# Altium schematic sheet STATUS_RGB.SchDoc
size Legal; Author: Mark & Qiming; DocumentNumber: 4; SheetNumber: 4; SheetTotal: 9
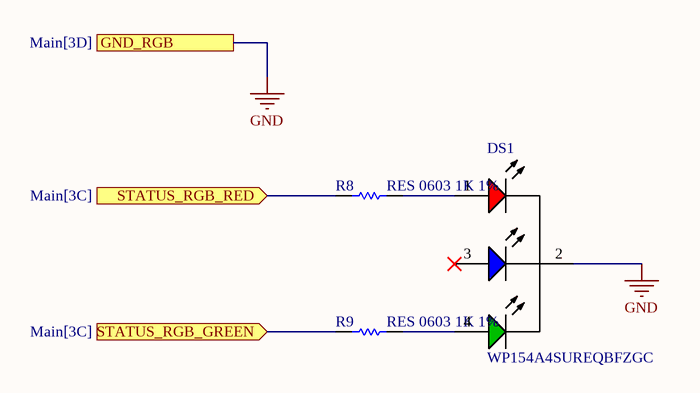
[diagram p0: STATUS_RGB.SchDoc]

## Parts
DS1  WP154A4SUREQBFZGC  [KING-WP154A4SUREQBFZGC_V]
R8  RES 0603 1K 1%  [0603_RES]
R9  RES 0603 1K 1%  [0603_RES]

## Ports
GND_RGB (see Main[3D]), STATUS_RGB_GREEN (in, see Main[3C]), STATUS_RGB_RED (in, see Main[3C])

## Nets
GND: DS1.2(CATHODE) ; port GND_RGB
STATUS_RGB_GREEN: R9.2 ; port STATUS_RGB_GREEN
STATUS_RGB_RED: R8.2 ; port STATUS_RGB_RED
NetDS1_1: DS1.1(RED) R8.1
NetDS1_4: DS1.4(GREEN) R9.1

Not connected (* = marked no-connect by the designer): DS1 3(BLUE)*

## Notes on the sheet
- Title:
- Desc:
- Size:
- Letter
- Auth:
- Proj:
- Sheet
- of
- www.seas.upenn.edu
- Electrical and Systems Engineering

## Library data of the parts
DS1 = CMP-2000-07415-1: Full Color LED Lamp, Dominant Wavelength RGB 630 / 525 / 465 nm, -40 to 85 degC, 4-Pin THD, RoHS; Manufacturer: Kingbright; Viewing Angle: 50°; Wavelength - Dominant: 630nm,525nm,465nm; Online Catalog: 5mm,T-13/4(RGB)RoundwithDomedTopLEDLamp; Millicandela Rating: 1300mcdRed,1700mcdGreen,900mcdBlue; Other Names: 754-1615 / WP154A4SUREQBFZGC-ND; Current - Test: 20mA; Wavelength - Peak: 645nm,515nm,460nm; Color: Red,Green,Blue(RGB); Voltage - Forward (Vf) (Typ): 1.9VRed,3.3VGreen,3.3VBlue; Lens Type: Clear; 3D Model: WP154A4SUREQBFZGW.sldprt / WP154A4SUREQBFZGW.pro / WP154A4SUREQBFZGW.igs / WP154A4SUREQBFZGW.stp; Lens Style/Size: RoundwithDomedTop,5mm,T-13/4; Packaging: Bulk; Datasheet URL: https://www.kingbrightusa.com/images/catalog/spec/WP154A4SUREQBFZGC.pdf; Family: LEDIndication-Discrete; Datasheet Version: Rev. 5A, 08/2014; Category: Optoelectronics; Manufacturer URL: http://www.kingbright.com/; Height: 8.60mm; Mounting Type: ThroughHole; Package Reference: WP154A4SUREQBFZGC; Mounting Technology: ThroughHole; Package Description: 4-Pin Through Hole LED, Dia 5.9 mm, Pitch 1.27 mm; Standard Package: 500; Package / Case: Radial-4Leads; ComponentLink1Description: New link; ComponentLink1URL: *
R8 R9 = CMP-005-002503-3: Resistor Surface Mount, 1K Ohms, 0603 Footprint, 1% Tolerance 0.1W; Manufacturer: Various; PCB Package: 0603; Description in Visual: Res SMT 1K 0603  1%  0.1W; Tolerance: 1%; Value: 1k; Mount: SMT; Power Rating: 0.1W; Manufacturer P/N: RES 0603 1K 1%; JLCPCB Part #: C21190